# Altium project DC Motor Controller.PrjPcb
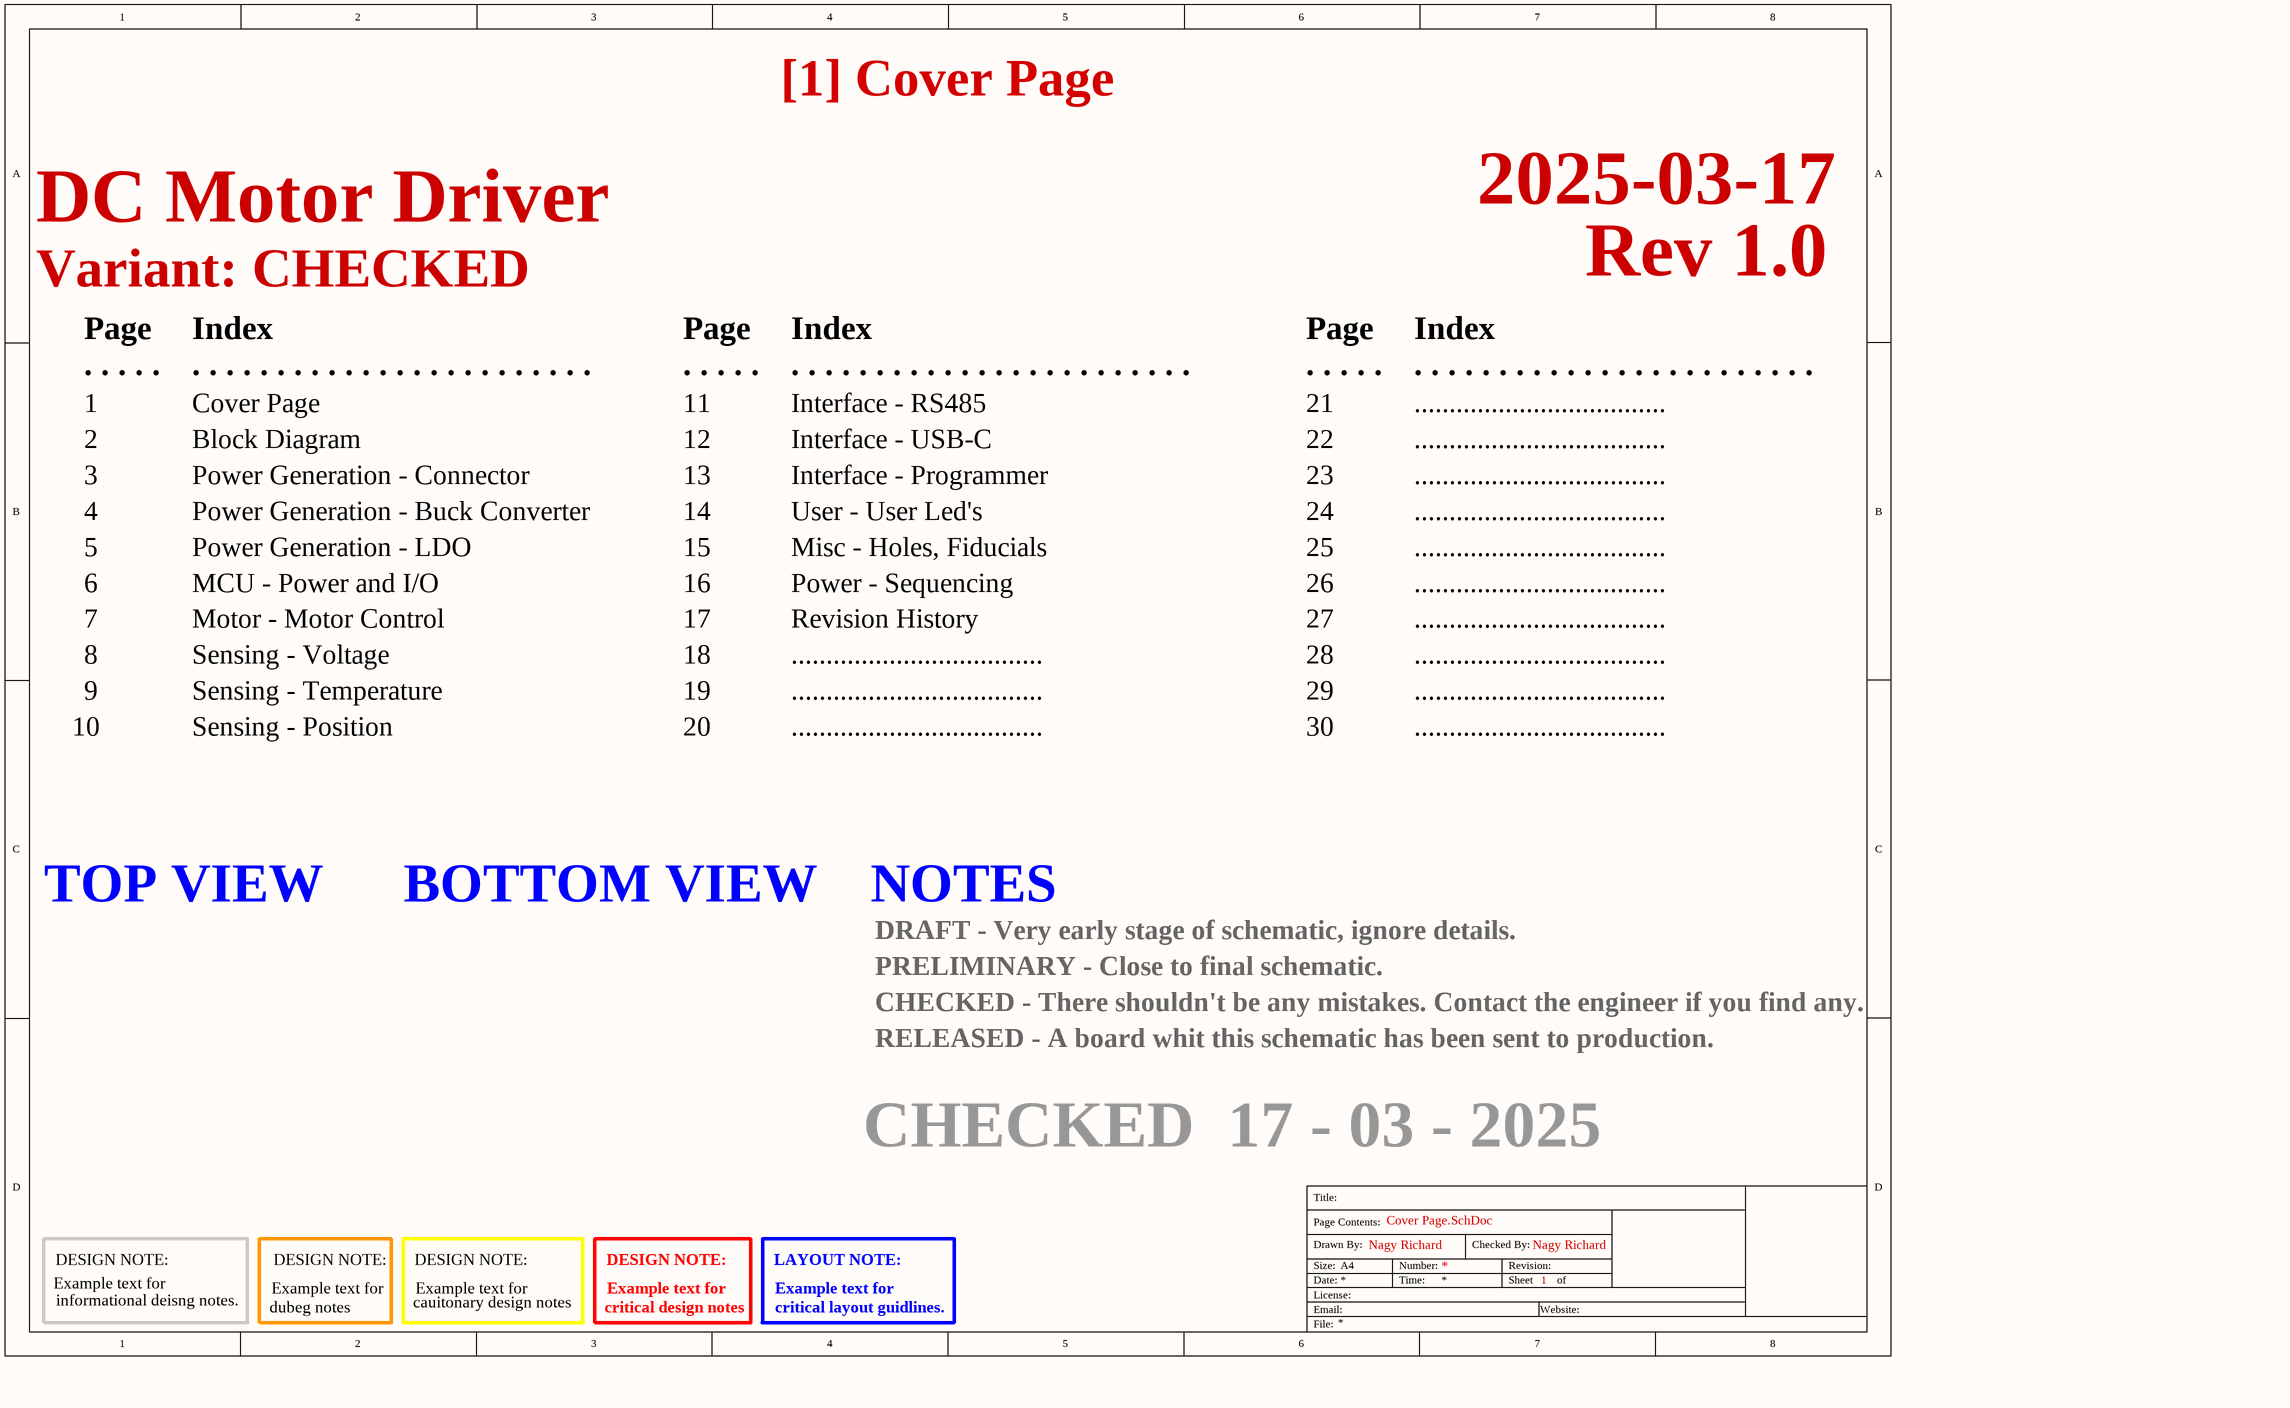
[diagram p0: Cover Page.SchDoc]
15 sheets, 95 parts. Net scope: global (net labels, ports and power ports of the same name join across sheets).
Board file: PCB.PcbDoc
Sheets:
  Cover Page.SchDoc
  Block Diagram.SchDoc
    U_Power Generation - Connector = Power Generation - Connector.SchDoc
    U_Power Generation - Buck Converter = Power Generation - Buck Converter.SchDoc
    U_Power Generation - LDO = Power Generation - LDO.SchDoc
    U_MCU - Power and I_O = MCU - Power and I_O.SchDoc
    U_Motor - Motor Control = Motor - Motor Control.SchDoc
    U_Sensing - Voltage = Sensing - Voltage.SchDoc
    U_Sensing - Temperature = Sensing - Temperature.SchDoc
    U_Sensing - Position = Sensing - Position.SchDoc
    U_Interface - RS485 = Interface - RS485.SchDoc
    U_Interface - USB-C = Interface - USB-C.SchDoc
    U_Interface - Programmer = Interface - Programmer.SchDoc
    U_User - User Led's = User - User Led's.SchDoc
  Misc - Holes, Fiducials.SchDoc

## Sheet Cover Page.SchDoc: [1] Cover Page
size A3; ApprovedBy: Nagy Richard; CheckedBy: Nagy Richard; Author: Nagy Richard; CompanyName: EmbedCore; DrawnBy: Nagy Richard; Engineer: Nagy Richard; Organization: EmbedCore; Revision: 1.0; SheetNumber: 1; SheetTotal: 15

### Notes on the sheet
- 2025-03-17
- DC Motor Driver
- Variant: CHECKED
- Page
- Index
- Rev 1.0
- . . . . .
- . . . . . . . . . . . . . . . . . . . . . . . .
- 1
- 2
- Cover Page
- Block Diagram
- 11
- 12
- Interface - RS485
- Interface - USB-C
- 21
- 22
- ....................................
- 3
- 4
- Power Generation - Connector
- Power Generation - Buck Converter
- 13
- 14
- Interface - Programmer
- User - User Led's
- 23
- 24
- 5
- Power Generation - LDO
- 15
- Misc - Holes, Fiducials
- 25
- 6
- 7
- MCU - Power and I/O
- Motor - Motor Control
- 16
- 17
- Power - Sequencing
- Revision History
- 26
- 27
- 8
- 9
- Sensing - Voltage
- Sensing - Temperature
- 18
- 19
- 28
- 29
- 10
- Sensing - Position
- 20
- 30
- TOP VIEW
- BOTTOM VIEW
- NOTES
- DRAFT - Very early stage of schematic, ignore details.
- CHECKED - There shouldn't be any mistakes. Contact the engineer if you find any.
- PRELIMINARY - Close to final schematic.
- RELEASED - A board whit this schematic has been sent to production.
- CHECKED  17 - 03 - 2025
- Example text for
- DESIGN NOTE:
- informational deisng notes.
- dubeg notes
- cauitonary design notes
- critical design notes
- LAYOUT NOTE:
- critical layout guidlines.
- Title:
- Drawn By:
- Page Contents:
- Checked By:
- Size:
- Date:
- File:
- License:
- Email:
- A4
- Number:
- Time:
- Revision:
- Sheet
- Website:
- of

## Sheet Block Diagram.SchDoc: [2] Block Diagram
size A4; ApprovedBy: Nagy Richard; CheckedBy: Nagy Richard; Author: Nagy Richard; CompanyName: EmbedCore; DrawnBy: Nagy Richard; Engineer: Nagy Richard; Organization: EmbedCore; DocumentNumber: 2; Revision: 1.0; SheetNumber: 2; SheetTotal: 14
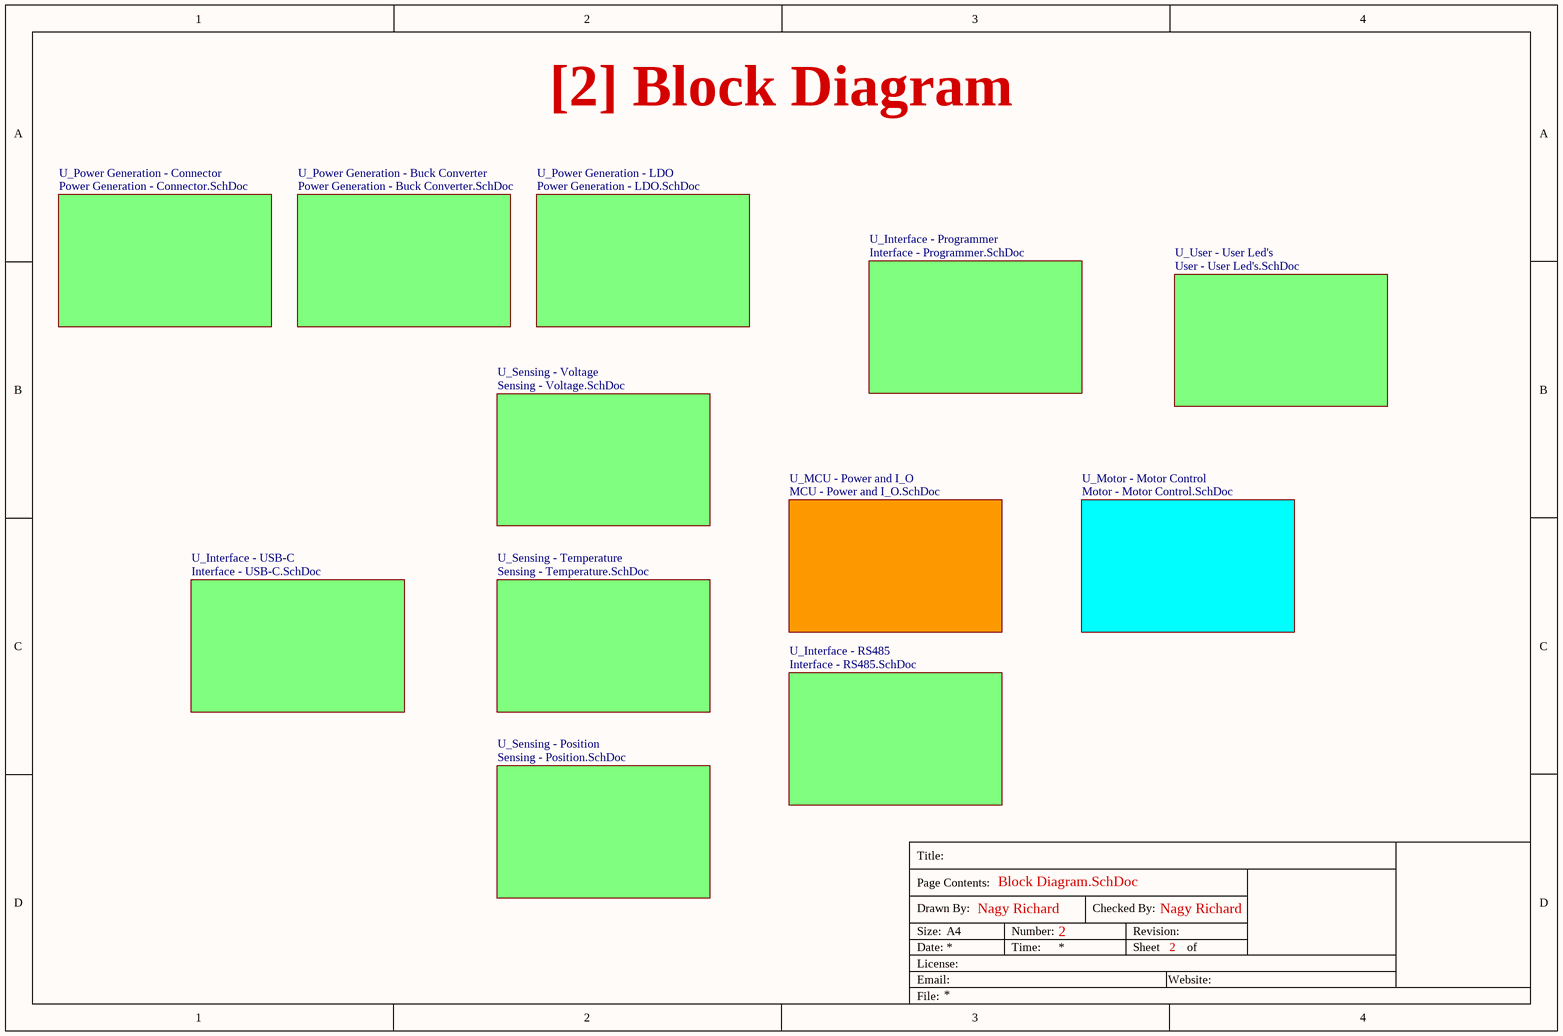
[diagram p1: Block Diagram.SchDoc]

### Sub-sheets
U_Interface - Programmer = Interface - Programmer.SchDoc: no entries
U_Interface - RS485 = Interface - RS485.SchDoc: no entries
U_Interface - USB-C = Interface - USB-C.SchDoc: no entries
U_MCU - Power and I_O = MCU - Power and I_O.SchDoc: no entries
U_Motor - Motor Control = Motor - Motor Control.SchDoc: no entries
U_Power Generation - Buck Converter = Power Generation - Buck Converter.SchDoc: no entries
U_Power Generation - Connector = Power Generation - Connector.SchDoc: no entries
U_Power Generation - LDO = Power Generation - LDO.SchDoc: no entries
U_Sensing - Position = Sensing - Position.SchDoc: no entries
U_Sensing - Temperature = Sensing - Temperature.SchDoc: no entries
U_Sensing - Voltage = Sensing - Voltage.SchDoc: no entries
U_User - User Led's = User - User Led's.SchDoc: no entries

### Notes on the sheet
- Title:
- Drawn By:
- Page Contents:
- Checked By:
- Size:
- Date:
- File:
- License:
- Email:
- A4
- Number:
- Time:
- Revision:
- Sheet
- Website:
- of

## Sheet Power Generation - Connector.SchDoc: [3] Power Generation - Connector
size A4; ApprovedBy: Nagy Richard; CheckedBy: Nagy Richard; Author: Nagy Richard; CompanyName: EmbedCore; DrawnBy: Nagy Richard; Engineer: Nagy Richard; Organization: EmbedCore; DocumentNumber: 3; Revision: 1.0; SheetNumber: 3; SheetTotal: 15
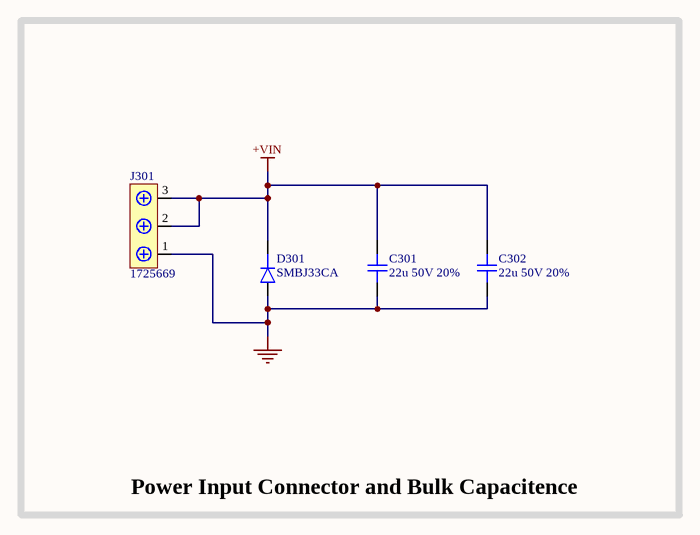
[diagram p2: Power Generation - Connector.SchDoc]

### Parts
C301  22u 50V 20%  [CAP-EL-NP-5MM]
C302  22u 50V 20%  [CAP-EL-NP-5MM]
D301  SMBJ33CA  [DO-214AC-2 (SMA)]
J301  1725669  [1725669]

### Blocks framed on the sheet
Power Input Connector and Bulk Capacitence: C301 C302 D301 J301

### Nets
+VIN: C301.1 C302.1 D301.K J301.2 J301.3
GND: C301.2 C302.2 D301.A J301.1

### Notes on the sheet
- Title:
- Drawn By:
- Page Contents:
- Checked By:
- Size:
- Date:
- File:
- License:
- Email:
- A4
- Number:
- Time:
- Revision:
- Sheet
- Website:
- of

### Library data of the parts
C301 C302 = CAP_EL_NP_5MM: Capacitor SMD Electrolytic Non-Polarised 5mm Diameter; Manufacturer: PANASONIC; Manufacturer Part Number: EEEFT1H220AR
D301 = D_SMA: Diode SMD SMA (DO-214AA); Manufacturer: Littelfuse; Manufacturer Part Number: SMBJ33CA
J301 = 1725669: Screw Terminal Block 3 Positions 2.54mm; Manufacturer: Phoenix; Manufacturer Part Number: 1725669; Distributor Link: https://www.mouser.de/ProductDetail/Phoenix-Contact/1725669?qs=A%2FKWGUWTCZjmkTL0Oe91ew%3D%3D

## Sheet Power Generation - Buck Converter.SchDoc: [4] Power Generation - Buck Converter
size A4; ApprovedBy: Nagy Richard; CheckedBy: Nagy Richard; Author: Nagy Richard; CompanyName: EmbedCore; DrawnBy: Nagy Richard; Engineer: Nagy Richard; Organization: EmbedCore; DocumentNumber: 4; Revision: 1.0; SheetNumber: 4; SheetTotal: 15
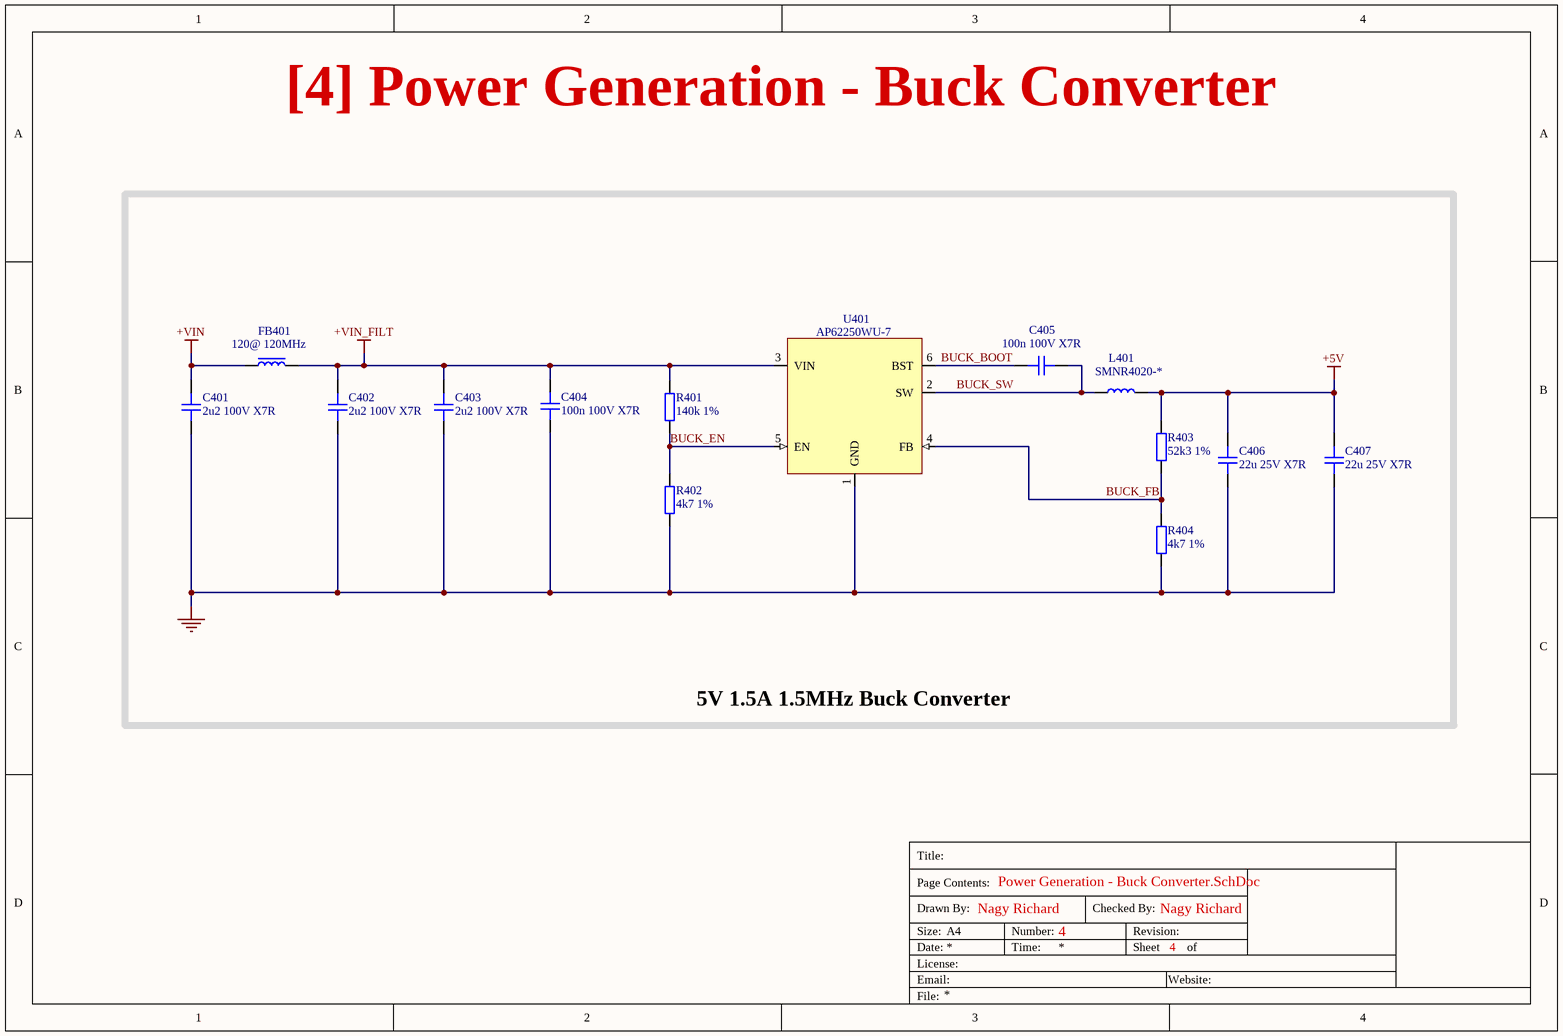
[diagram p3: Power Generation - Buck Converter.SchDoc]

### Parts
C401  2u2 100V X7R  [CAP_0805]
C402  2u2 100V X7R  [CAP_0805]
C403  2u2 100V X7R  [CAP_0805]
C404  100n 100V X7R  [CAP_0805]
C405  100n 100V X7R  [CAP_0805]
C406  22u 25V X7R  [CAP_0805]
C407  22u 25V X7R  [CAP_0805]
FB401  120@ 120MHz  [FB_0805]
L401  SMNR4020-*  [SMNR4020]
R401  140k 1%  [RES_0603]
R402  4k7 1%  [RES_0603]
R403  52k3 1%  [RES_0603]
R404  4k7 1%  [RES_0603]
U401  AP62250WU-7  [TSOT-26-6]

### Blocks framed on the sheet
5V 1.5A 1.5MHz Buck Converter: C401-C407 FB401 L401 R401-R404 U401

### Nets
+5V: C406.2 C407.2 L401.2 R403.2
+VIN: C401.2 FB401.1
+VIN_FILT: C402.2 C403.2 C404.2 FB401.2 R401.2 U401.3(VIN)
GND: C401.1 C402.1 C403.1 C404.1 C406.1 C407.1 R402.1 R404.1 U401.1(GND)
BUCK_BOOT: C405.2 U401.6(BST)
BUCK_EN: R401.1 R402.2 U401.5(EN)
BUCK_FB: R403.1 R404.2 U401.4(FB)
BUCK_SW: C405.1 L401.1 U401.2(SW)

### Notes on the sheet
- Title:
- Drawn By:
- Page Contents:
- Checked By:
- Size:
- Date:
- File:
- License:
- Email:
- A4
- Number:
- Time:
- Revision:
- Sheet
- Website:
- of

### Library data of the parts
C401-C403 C406 C407 = CAP_0805: Capacitor SMD 0805; Manufacturer: *; Manufacturer Part Number: *; Distributor Link: *; LCSC: *; Rating: *; Dielectric: *
C404 C405 = CAP_0805: Capacitor SMD 0805; Manufacturer: HUI JU; Manufacturer Part Number: NM0805B104K101CEDN; Distributor Link: www.lcsc.com; LCSC: C710457; Rating: *; Dielectric: *
FB401 = FB_0805: Ferrite Bead SMD 0805; Manufacturer: Murata Electronics; Manufacturer Part Number: BLM21AG121SN1D; Distributor Link: www.lcsc.com; LCSC: C88990
L401 = SMNR4020-*: Inductor SXN SMNR4020 Series 4x4x2mm; Manufacturer Part Number: SMNR4020-5R6MT; Manufacturer: SXN; Distributor Link: www.lcsc.com; LCSC: C467062
R401 = RES_0603: Resistor SMD 0603; Manufacturer: YAGEO; Manufacturer Part Number: RC0603FR-07140KL; Distributor Link: www.lcsc.com; LCSC: C185372
R402 R404 = RES_0603: Resistor SMD 0603; Manufacturer: UNI-ROYAL(Uniroyal Elec); Manufacturer Part Number: 0603WAF4701T5E; Distributor Link: www.lcsc.com; LCSC: C23162
R403 = RES_0603: Resistor SMD 0603; Manufacturer: UNI-ROYAL(Uniroyal Elec); Manufacturer Part Number: 0603WAF5232T5E; Distributor Link: www.lcsc.com; LCSC: C23198
U401 = AP62250WU-7: 4.2V TO 18V INPUT, 2.5A LOW IQ SYNCHRONOUS BUCK CONVERTER; Manufacturer: Diodes Incorporated; Manufacturer Part Number: AP62250WU-7; Distributor Link: https://www.mouser.de/ProductDetail/Diodes-Incorporated/AP62250WU-7?qs=7MVldsJ5Uax1PUc8sdeimQ%3D%3D

## Sheet Power Generation - LDO.SchDoc: [4] Power Generation - LDO
size A4; ApprovedBy: Nagy Richard; CheckedBy: Nagy Richard; Author: Nagy Richard; CompanyName: EmbedCore; DrawnBy: Nagy Richard; Engineer: Nagy Richard; Organization: EmbedCore; DocumentNumber: 5; Revision: 1.0; SheetNumber: 5; SheetTotal: 5
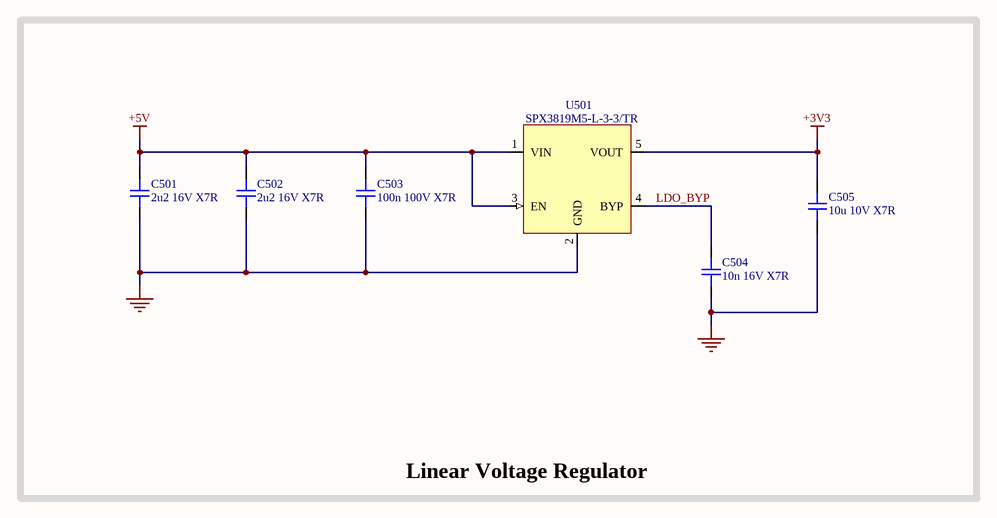
[diagram p4: Power Generation - LDO.SchDoc]

### Parts
C501  2u2 16V X7R  [CAP_0805]
C502  2u2 16V X7R  [CAP_0805]
C503  100n 100V X7R  [CAP_0805]
C504  10n 16V X7R  [CAP_0603]
C505  10u 10V X7R  [CAP_0805]
U501  SPX3819M5-L-3-3/TR  [SOT-23-5]

### Blocks framed on the sheet
Linear Voltage Regulator: C501-C505 U501

### Nets
+3V3: C505.1 U501.5(VOUT)
+5V: C501.1 C502.1 C503.1 U501.1(VIN) U501.3(EN)
GND: C501.2 C502.2 C503.2 C504.1 C505.2 U501.2(GND)
LDO_BYP: C504.2 U501.4(BYP)

### Notes on the sheet
- Title:
- Drawn By:
- Page Contents:
- Checked By:
- Size:
- Date:
- File:
- License:
- Email:
- A4
- Number:
- Time:
- Revision:
- Sheet
- Website:
- of

### Library data of the parts
C501 C502 = CAP_0805: Capacitor SMD 0805; Manufacturer: HRE; Manufacturer Part Number: CGA0805X7R225K160MT; Distributor Link: www.lcsc.com; LCSC: C6119936; Rating: *; Dielectric: *
C503 = CAP_0805: Capacitor SMD 0805; Manufacturer: YAGEO; Manufacturer Part Number: CC0805JRX7R7BB104; Distributor Link: www.lcsc.com; LCSC: CC0805JRX7R7BB104; Rating: *; Dielectric: *
C504 = CAP_0603: Capacitor SMD 0603; Manufacturer: YAGEO; Manufacturer Part Number: CC0603JRX7R7BB103; Distributor Link: www.lcsc.com; LCSC: C519509; Rating: *; Dielectric: *
C505 = CAP_0805: Capacitor SMD 0805; Manufacturer: Murata Electronics; Manufacturer Part Number: GCM21BR71A106KE22K; Distributor Link: www.lcsc.com; LCSC: C2167756; Rating: *; Dielectric: *
U501 = SPX3819M5-L-3-3/TR: 500mA +3.3V Low-Noise LDO Voltage Regulator; Manufacturer: MaxLinear; Manufacturer Part Number: SPX3819M5-L-3-3/TR

## Sheet MCU - Power and I_O.SchDoc: [6] MCU - Power and I/O
size A4; ApprovedBy: Nagy Richard; CheckedBy: Nagy Richard; Author: Nagy Richard; CompanyName: EmbedCore; DrawnBy: Nagy Richard; Engineer: Nagy Richard; DocumentNumber: 6; Revision: 1.0; SheetNumber: 6; SheetTotal: 15
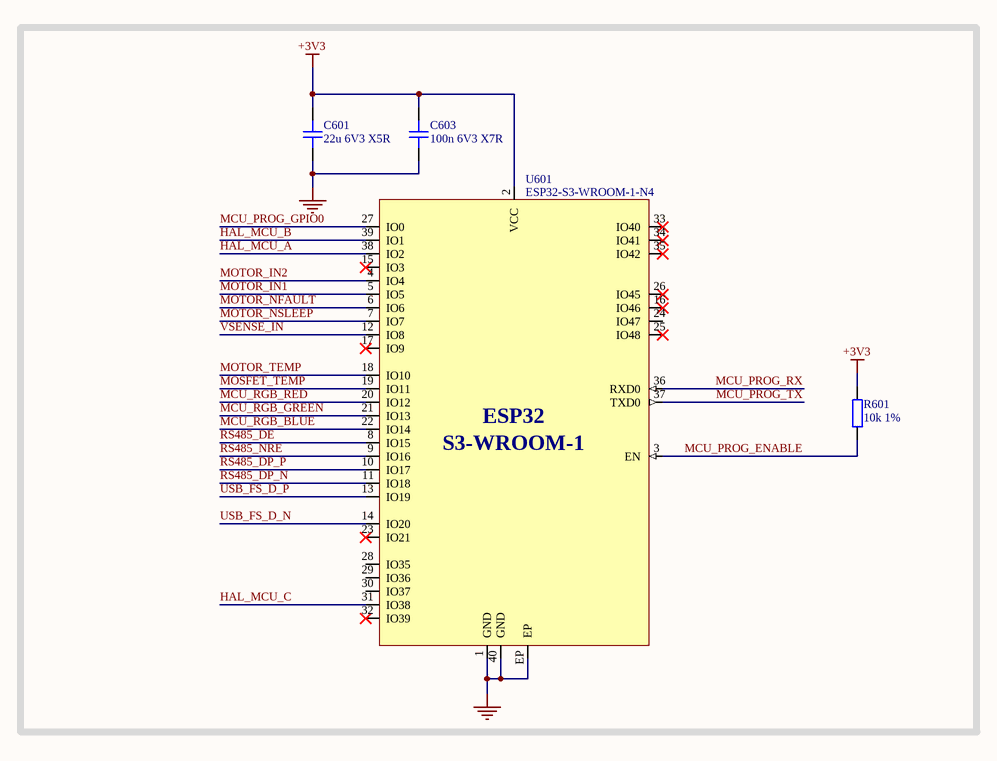
[diagram p5: MCU - Power and I_O.SchDoc]

### Parts
C601  22u 6V3 X5R  [CAP_0603]
C603  100n 6V3 X7R  [CAP_0402]
R601  10k 1%  [RES_0402]
U601  ESP32-S3-WROOM-1-N4  [ESP32-S3-WROOM-1]

### Nets
+3V3: C601.2 C603.2 R601.2 U601.2(VCC)
GND: C601.1 C603.1 U601.1(GND) U601.40(GND) U601.EP
HAL_MCU_A: U601.38(IO2)
HAL_MCU_B: U601.39(IO1)
HAL_MCU_C: U601.31(IO38)
MCU_PROG_ENABLE: R601.1 U601.3(EN)
MCU_PROG_GPIO0: U601.27(IO0)
MCU_PROG_RX: U601.36(RXD0)
MCU_PROG_TX: U601.37(TXD0)
MCU_RGB_BLUE: U601.22(IO14)
MCU_RGB_GREEN: U601.21(IO13)
MCU_RGB_RED: U601.20(IO12)
MOSFET_TEMP: U601.19(IO11)
MOTOR_IN1: U601.5(IO5)
MOTOR_IN2: U601.4(IO4)
MOTOR_NFAULT: U601.6(IO6)
MOTOR_NSLEEP: U601.7(IO7)
MOTOR_TEMP: U601.18(IO10)
RS485_DE: U601.8(IO15)
RS485_DP_N: U601.11(IO18)
RS485_DP_P: U601.10(IO17)
RS485_NRE: U601.9(IO16)
USB_FS_D_N: U601.14(IO20)
USB_FS_D_P: U601.13(IO19)
VSENSE_IN: U601.12(IO8)

Not connected (* = marked no-connect by the designer): U601 15(IO3)* 16(IO46)* 17(IO9)* 23(IO21)* 24(IO47) 25(IO48)* 26(IO45)* 28(IO35) 29(IO36) 30(IO37) 32(IO39)* 33(IO40)* 34(IO41)* 35(IO42)*

### Notes on the sheet
- Title:
- Drawn By:
- Page Contents:
- Checked By:
- Size:
- Date:
- File:
- License:
- Email:
- A4
- Number:
- Time:
- Revision:
- Sheet
- Website:
- of
- (in symbol ESP32-S3-WROOM-1-N4) ESP32; S3-WROOM-1

### Library data of the parts
C601 = CAP_0603: Capacitor SMD 0603; Manufacturer: Samsung Electro-Mechanics; Manufacturer Part Number: CL10A226MQ8NRNC; Distributor Link: www.lcsc.com; LCSC: C59461; Rating: *; Dielectric: *
C603 = CAP_0402: Capacitor SMD 0402; Manufacturer: YAGEO; Manufacturer Part Number: CC0402KRX7R5BB104; Distributor Link: www.lcsc.com; LCSC: C541406; Rating: *; Dielectric: *
R601 = RES_0402: Resistor SMD 0402; Manufacturer: PANASONIC; Manufacturer Part Number: ERJPA2F1002X; Distributor Link: www.lcsc.com; LCSC: C427247
U601 = ESP32-S3-WROOM-1-N4: 2.4 GHz Wi-Fi (802.11 b/g/n) and Bluetooth 5 (LE) Module ESP32-S3, 4MB Flash, on-board PCB antenna); Manufacturer: Espressif; Manufacturer Part Number: ESP32-S3-WROOM-1-N4; Distributor Link: https://www.mouser.de/ProductDetail/Espressif-Systems/ESP32-S3-WROOM-1-N4?qs=Li%252BoUPsLEnsO%2FkiJOUK0FQ%3D%3D

## Sheet Motor - Motor Control.SchDoc: [7] Motor - Motor Control
size A4; ApprovedBy: Nagy Richard; CheckedBy: Nagy Richard; Author: Nagy Richard; CompanyName: EmbedCore; DrawnBy: Nagy Richard; Engineer: Nagy Richard; Organization: EmbedCore; DocumentNumber: 7; Revision: 1.0; SheetNumber: 7; SheetTotal: 15
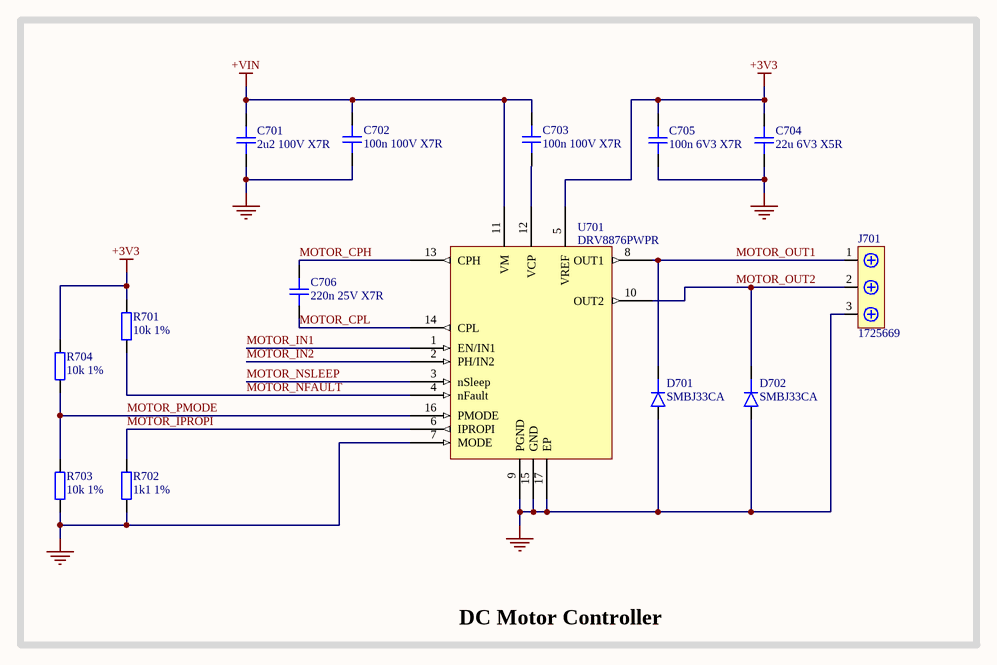
[diagram p6: Motor - Motor Control.SchDoc]

### Parts
C701  2u2 100V X7R  [CAP_0805]
C702  100n 100V X7R  [CAP_0603]
C703  100n 100V X7R  [CAP_0603]
C704  22u 6V3 X5R  [CAP_0603]
C705  100n 6V3 X7R  [CAP_0402]
C706  220n 25V X7R  [CAP_0603]
D701  SMBJ33CA  [DO-214AC-2 (SMA)]
D702  SMBJ33CA  [DO-214AC-2 (SMA)]
J701  1725669  [1725669]
R701  10k 1%  [RES_0402]
R702  1k1 1%  [RES_0402]
R703  10k 1%  [RES_0402]
R704  10k 1%  [RES_0402]
U701  DRV8876PWPR  [SOP65P640X120-16N]

### Blocks framed on the sheet
DC Motor Controller: C701-C706 D701 D702 J701 R701-R704 U701

### Nets
+3V3: C704.2 C705.2 R701.2 R704.2 U701.5(VREF)
+VIN: C701.2 C702.2 C703.2 U701.11(VM)
GND: C701.1 C702.1 C704.1 C705.1 D701.A D702.A J701.3 R702.1 R703.1 U701.7(MODE) U701.9(PGND) U701.15(GND) U701.17(EP)
MOTOR_CPH: C706.2 U701.13(CPH)
MOTOR_CPL: C706.1 U701.14(CPL)
MOTOR_IN1: U701.1(EN/IN1)
MOTOR_IN2: U701.2(PH/IN2)
MOTOR_IPROPI: R702.2 U701.6(IPROPI)
MOTOR_NFAULT: R701.1 U701.4(nFault)
MOTOR_NSLEEP: U701.3(nSleep)
MOTOR_OUT1: D701.K J701.1 U701.8(OUT1)
MOTOR_OUT2: D702.K J701.2 U701.10(OUT2)
MOTOR_PMODE: R703.2 R704.1 U701.16(PMODE)
NetC703_1: C703.1 U701.12(VCP)

### Notes on the sheet
- Title:
- Drawn By:
- Page Contents:
- Checked By:
- Size:
- Date:
- File:
- License:
- Email:
- A4
- Number:
- Time:
- Revision:
- Sheet
- Website:
- of

### Library data of the parts
C701 = CAP_0805: Capacitor SMD 0805; Manufacturer: *; Manufacturer Part Number: *; Distributor Link: *; LCSC: *; Rating: *; Dielectric: *
C702 C703 = CAP_0603: Capacitor SMD 0603; Manufacturer: *; Manufacturer Part Number: *; Distributor Link: *; LCSC: *; Rating: *; Dielectric: *
C704 C706 = CAP_0603: as C601 on sheet MCU - Power and I_O; Distributor Link: www.lcsc.com; Rating: *; Dielectric: *
  C704: LCSC: C59461
  C706: LCSC: C21120
C705 = CAP_0402: as C603 on sheet MCU - Power and I_O; Distributor Link: www.lcsc.com; LCSC: C541406; Rating: *; Dielectric: *
D701 D702 = D_SMA: as D301 on sheet Power Generation - Connector; Manufacturer Part Number: SMBJ33CA
J701 = 1725669: as J301 on sheet Power Generation - Connector; Manufacturer Part Number: 1725669; Distributor Link: https://www.mouser.de/ProductDetail/Phoenix-Contact/1725669?qs=A%2FKWGUWTCZjmkTL0Oe91ew%3D%3D
R701-R704 = RES_0402: as R601 on sheet MCU - Power and I_O; Distributor Link: www.lcsc.com
  R701 R703 R704: LCSC: C427247
  R702: LCSC: C409028
U701 = DRV8876PWPR: DRV8876 H-Bridge Motor Driver With Integrated Current Sense and Regulation; Manufacturer: Texas Instruments; LCSC: C575551

## Sheet Sensing - Voltage.SchDoc: [8] Sensing - Voltage
size A4; ApprovedBy: Nagy Richard; CheckedBy: Nagy Richard; Author: Nagy Richard; CompanyName: EmbedCore; DrawnBy: Nagy Richard; Engineer: Nagy Richard; Organization: EmbedCore; DocumentNumber: 8; Revision: 1.0; SheetNumber: 8; SheetTotal: 8
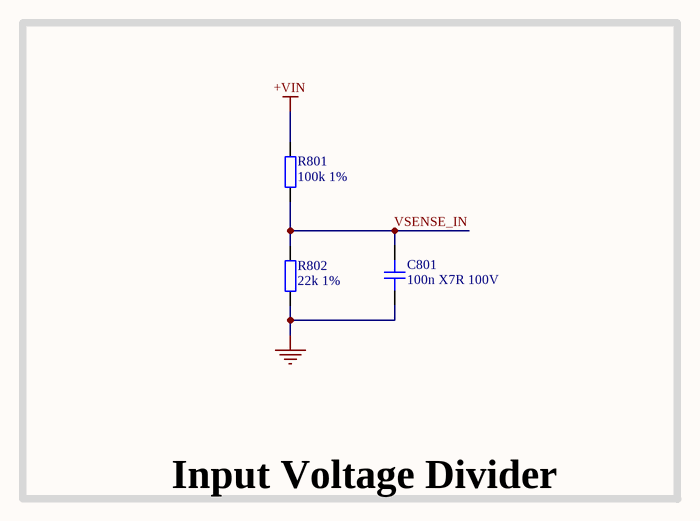
[diagram p7: Sensing - Voltage.SchDoc]

### Parts
C801  100n X7R 100V  [CAP_0603]
R801  100k 1%  [RES_0603]
R802  22k 1%  [RES_0603]

### Blocks framed on the sheet
Input Voltage Divider: C801 R801 R802

### Nets
+VIN: R801.2
GND: C801.1 R802.1
VSENSE_IN: C801.2 R801.1 R802.2

### Notes on the sheet
- Title:
- Drawn By:
- Page Contents:
- Checked By:
- Size:
- Date:
- File:
- License:
- Email:
- A4
- Number:
- Time:
- Revision:
- Sheet
- Website:
- of

### Library data of the parts
C801 = CAP_0603: Capacitor SMD 0603; Manufacturer: CCTC; Manufacturer Part Number: TCC0603X7R104K101CT; Distributor Link: www.lcsc.com; LCSC: C696916; Rating: *; Dielectric: *
R801 = RES_0603: Resistor SMD 0603; Manufacturer: Vishay Intertech; Manufacturer Part Number: MCT06030C1003FP500; Distributor Link: www.lcsc.com; LCSC: C161805
R802 = RES_0603: Resistor SMD 0603; Manufacturer: Vishay Intertech; Manufacturer Part Number: CRCW060322K0FKEA; Distributor Link: www.lcsc.com; LCSC: C844758

## Sheet Sensing - Temperature.SchDoc: [9] Sensing - Temperature
size A4; ApprovedBy: Nagy Richard; CheckedBy: Nagy Richard; Author: Nagy Richard; CompanyName: EmbedCore; DrawnBy: Nagy Richard; Engineer: Nagy Richard; Organization: EmbedCore; DocumentNumber: 9; Revision: 1.0; SheetNumber: 9; SheetTotal: 15
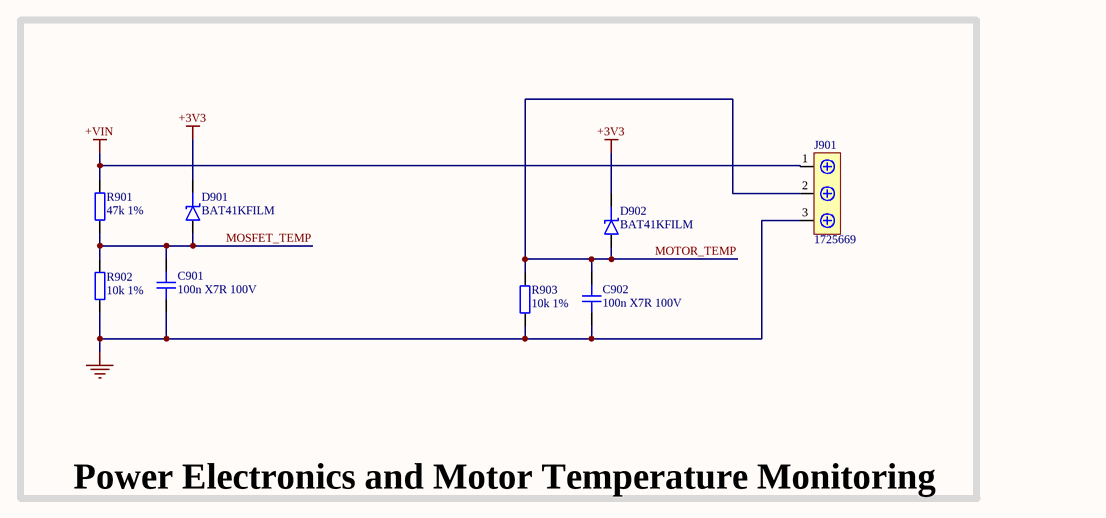
[diagram p8: Sensing - Temperature.SchDoc]

### Parts
C901  100n X7R 100V  [CAP_0603]
C902  100n X7R 100V  [CAP_0603]
D901  BAT41KFILM  [SOD-523]
D902  BAT41KFILM  [SOD-523]
J901  1725669  [1725669]
R901  47k 1%  [RES_0603]
R902  10k 1%  [RES_0603]
R903  10k 1%  [RES_0603]

### Blocks framed on the sheet
Power Electronics and Motor Temperature Monitoring: C901 C902 D901 D902 J901 R901-R903

### Nets
+3V3: D901.K D902.K
+VIN: J901.1 R901.2
GND: C901.1 C902.1 J901.3 R902.1 R903.1
MOSFET_TEMP: C901.2 D901.A R901.1 R902.2
MOTOR_TEMP: C902.2 D902.A J901.2 R903.2

### Notes on the sheet
- Title:
- Drawn By:
- Page Contents:
- Checked By:
- Size:
- Date:
- File:
- License:
- Email:
- A4
- Number:
- Time:
- Revision:
- Sheet
- Website:
- of

### Library data of the parts
C901 C902 = CAP_0603: as C801 on sheet Sensing - Voltage; Distributor Link: www.lcsc.com; LCSC: C696916; Rating: *; Dielectric: *
D901 D902 = D_SCHOTTKY_SOD_523: Diode Schottky SMD SOD-323; Manufacturer: STMicroelectronics; Manufacturer Part Number: BAT41KFILM; LCSC: C73150
J901 = 1725669: as J301 on sheet Power Generation - Connector; Manufacturer Part Number: 1725669; Distributor Link: https://www.mouser.de/ProductDetail/Phoenix-Contact/1725669?qs=A%2FKWGUWTCZjmkTL0Oe91ew%3D%3D
R901 = RES_0603: Resistor SMD 0603; Manufacturer: Vishay Intertech; Manufacturer Part Number: NTCS0603E3473FHT; Distributor Link: www.lcsc.com; LCSC: C511055
R902 R903 = RES_0603: as R401 on sheet Power Generation - Buck Converter; Distributor Link: www.lcsc.com; LCSC: C185372

## Sheet Sensing - Position.SchDoc: [10] Sensing - Position
size A4; ApprovedBy: Nagy Richard; CheckedBy: Nagy Richard; Author: Nagy Richard; CompanyName: EmbedCore; DrawnBy: Nagy Richard; Engineer: Nagy Richard; Organization: EmbedCore; DocumentNumber: 10; Revision: 1.0; SheetNumber: 10; SheetTotal: 15
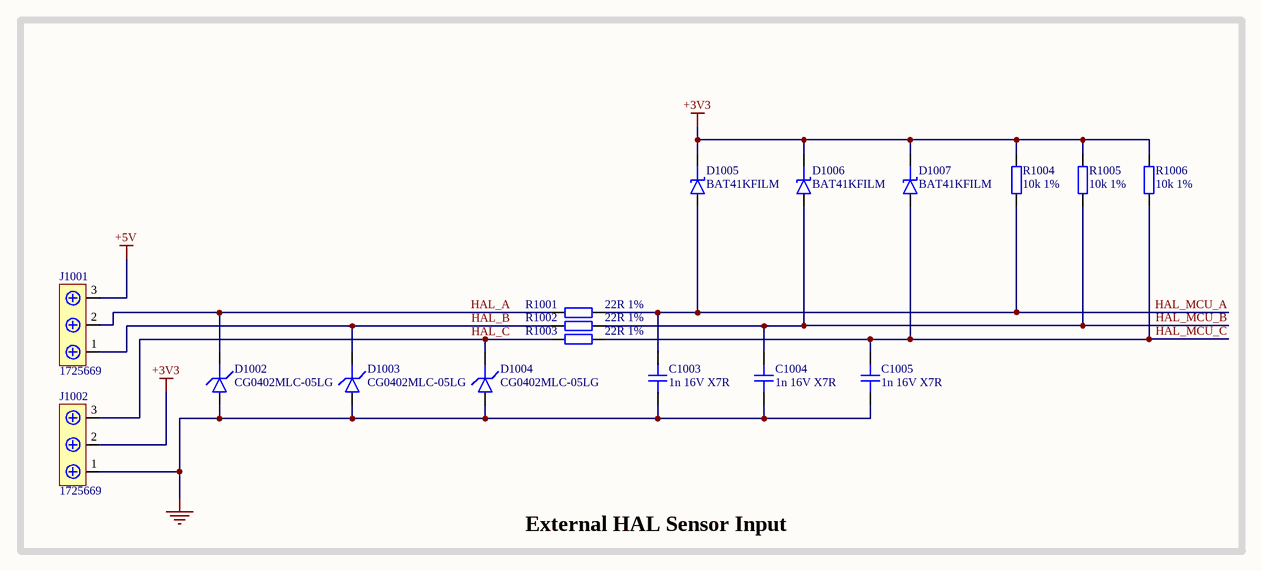
[diagram p9: Sensing - Position.SchDoc]

### Parts
C1003  1n 16V X7R  [CAP_0402]
C1004  1n 16V X7R  [CAP_0402]
C1005  1n 16V X7R  [CAP_0402]
D1002  CG0402MLC-05LG  [D_0402]
D1003  CG0402MLC-05LG  [D_0402]
D1004  CG0402MLC-05LG  [D_0402]
D1005  BAT41KFILM  [SOD-523]
D1006  BAT41KFILM  [SOD-523]
D1007  BAT41KFILM  [SOD-523]
J1001  1725669  [1725669]
J1002  1725669  [1725669]
R1001  22R 1%  [RES_0402]
R1002  22R 1%  [RES_0402]
R1003  22R 1%  [RES_0402]
R1004  10k 1%  [RES_0402]
R1005  10k 1%  [RES_0402]
R1006  10k 1%  [RES_0402]

### Blocks framed on the sheet
External HAL Sensor Input: C1003-C1005 D1002-D1007 J1001 J1002 R1001-R1006

### Nets
+3V3: D1005.K D1006.K D1007.K J1002.2 R1004.2 R1005.2 R1006.2
+5V: J1001.3
GND: C1003.1 C1004.1 C1005.1 D1002.A D1003.A D1004.A J1002.1
HAL_A: D1002.K J1001.2 R1001.2
HAL_B: D1003.K J1001.1 R1002.2
HAL_C: D1004.K J1002.3 R1003.2
HAL_MCU_A: C1003.2 D1005.A R1001.1 R1004.1
HAL_MCU_B: C1004.2 D1006.A R1002.1 R1005.1
HAL_MCU_C: C1005.2 D1007.A R1003.1 R1006.1

### Notes on the sheet
- Title:
- Drawn By:
- Page Contents:
- Checked By:
- Size:
- Date:
- File:
- License:
- Email:
- A4
- Number:
- Time:
- Revision:
- Sheet
- Website:
- of

### Library data of the parts
C1003-C1005 = CAP_0402: Capacitor SMD 0402; Manufacturer: YAGEO; Manufacturer Part Number: CC0402KRX7R7BB102; Distributor Link: www.lcsc.com; LCSC: C189467; Rating: *; Dielectric: *
D1002 = D_TVS_0402: Diode TVS / ESD 0402; Manufacturer: BOURNS; Manufacturer Part Number: CG0402MLC-05LG; LCSC: C711709
D1003 D1004 = D_TVS_0402: Diode TVS / ESD 0402
D1005-D1007 = D_SCHOTTKY_SOD_523: as D901 on sheet Sensing - Temperature; Manufacturer Part Number: BAT41KFILM; LCSC: C73150
J1001 J1002 = 1725669: as J301 on sheet Power Generation - Connector; Manufacturer Part Number: 1725669; Distributor Link: https://www.mouser.de/ProductDetail/Phoenix-Contact/1725669?qs=A%2FKWGUWTCZjmkTL0Oe91ew%3D%3D
R1001-R1003 = RES_0402: Resistor SMD 0402; Manufacturer: PANASONIC; Manufacturer Part Number: ERJPA2F22R0X; Distributor Link: www.lcsc.com; LCSC: C427230
R1004-R1006 = RES_0402: as R601 on sheet MCU - Power and I_O; Distributor Link: www.lcsc.com; LCSC: C427247

## Sheet Interface - RS485.SchDoc: [11] Interface - RS485
size A4; ApprovedBy: Nagy Richard; CheckedBy: Nagy Richard; Author: Nagy Richard; CompanyName: EmbedCore; DrawnBy: Nagy Richard; Engineer: Nagy Richard; Organization: EmbedCore; DocumentNumber: 11; Revision: 1.0; SheetNumber: 11; SheetTotal: 11
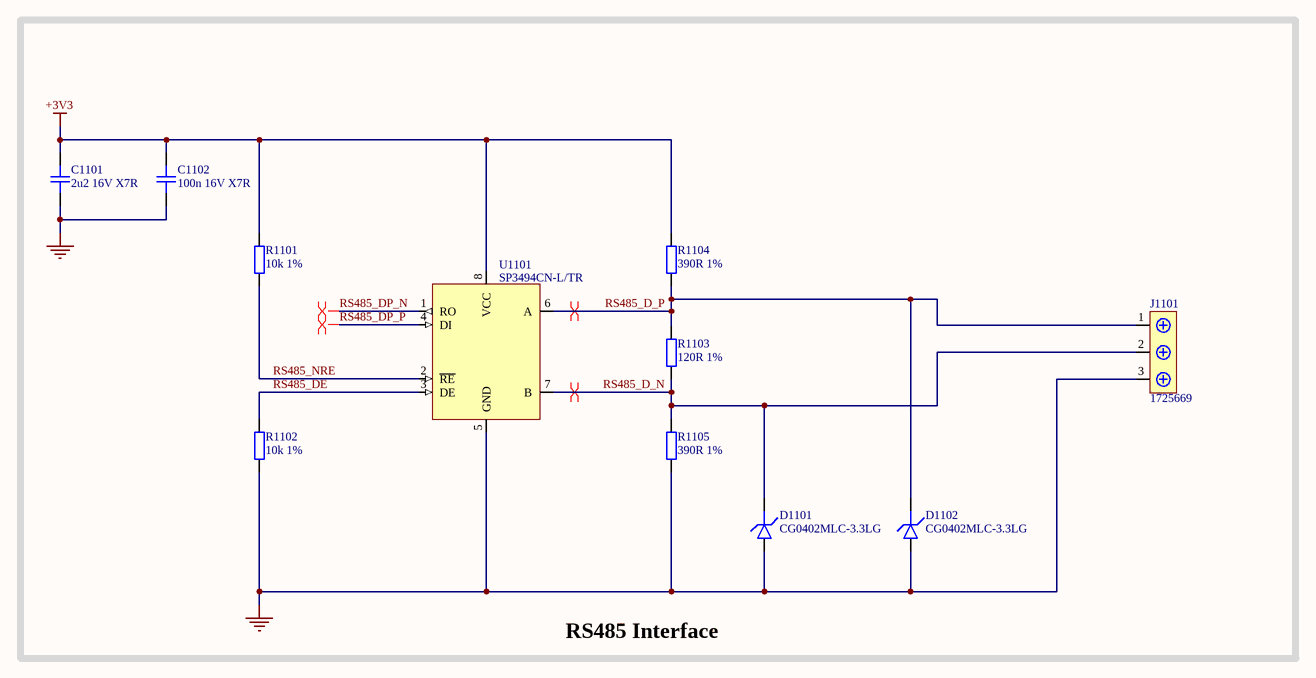
[diagram p10: Interface - RS485.SchDoc]

### Parts
C1101  2u2 16V X7R  [CAP_0603]
C1102  100n 16V X7R  [CAP_0402]
D1101  CG0402MLC-3.3LG  [D_0402]
D1102  CG0402MLC-3.3LG  [D_0402]
J1101  1725669  [1725669]
R1101  10k 1%  [RES_0402]
R1102  10k 1%  [RES_0402]
R1103  120R 1%  [RES_0402]
R1104  390R 1%  [RES_0402]
R1105  390R 1%  [RES_0402]
U1101  SP3494CN-L/TR  [SOIC-8]

### Blocks framed on the sheet
RS485 Interface: C1101 C1102 D1101 D1102 J1101 R1101-R1105 U1101

### Nets
+3V3: C1101.2 C1102.2 R1101.2 R1104.2 U1101.8(VCC)
GND: C1101.1 C1102.1 D1101.A D1102.A J1101.3 R1102.1 R1105.1 U1101.5(GND)
RS485_D_N: D1101.K J1101.2 R1103.1 R1105.2 U1101.7(B)
RS485_D_P: D1102.K J1101.1 R1103.2 R1104.1 U1101.6(A)
RS485_DE: R1102.2 U1101.3(DE)
RS485_DP_N: U1101.1(RO)
RS485_DP_P: U1101.4(DI)
RS485_NRE: R1101.1 U1101.2(~{RE})

### Layout directives
differential pair: RS485_D_N, RS485_D_P, RS485_DP_N, RS485_DP_P

### Notes on the sheet
- Title:
- Drawn By:
- Page Contents:
- Checked By:
- Size:
- Date:
- File:
- License:
- Email:
- A4
- Number:
- Time:
- Revision:
- Sheet
- Website:
- of

### Library data of the parts
C1101 = CAP_0603: Capacitor SMD 0603; Manufacturer: YAGEO; Manufacturer Part Number: CC0603KRX7R7BB225; Distributor Link: www.lcsc.com; LCSC: C914769; Rating: *; Dielectric: *
C1102 = CAP_0402: Capacitor SMD 0402; Manufacturer: YAGEO; Manufacturer Part Number: CC0402JRX7R7BB104; Distributor Link: www.lcsc.com; LCSC: C541464; Rating: *; Dielectric: *
D1101 D1102 = D_TVS_0402: Diode TVS / ESD 0402
J1101 = 1725669: as J301 on sheet Power Generation - Connector; Manufacturer Part Number: 1725669; Distributor Link: https://www.mouser.de/ProductDetail/Phoenix-Contact/1725669?qs=A%2FKWGUWTCZjmkTL0Oe91ew%3D%3D
R1101 R1102 = RES_0402: as R601 on sheet MCU - Power and I_O; Distributor Link: www.lcsc.com; LCSC: C427247
R1103 = RES_0402: Resistor SMD 0402; Manufacturer: PANASONIC; Manufacturer Part Number: ERJ2GEJ121X; Distributor Link: www.lcsc.com; LCSC: C412974
R1104 R1105 = RES_0402: Resistor SMD 0402; Manufacturer: PANASONIC; Manufacturer Part Number: ERJ2GEJ391X; Distributor Link: www.lcsc.com; LCSC: C412983
U1101 = SP3494CN-L/TR: 3.3V Low Power RS-485 / RS-422 Transceiver SOIC-8; Manufacturer: MaxLinear; Manufacturer Part Number: SP3494CN-L/TR

## Sheet Interface - USB-C.SchDoc: [12] Interface - USB-C
size A4; ApprovedBy: Nagy Richard; CheckedBy: Nagy Richard; Author: Nagy Richard; CompanyName: EmbedCore; DrawnBy: Nagy Richard; Engineer: Nagy Richard; Organization: EmbedCore; DocumentNumber: 12; Revision: 1.0; SheetNumber: 12; SheetTotal: 15
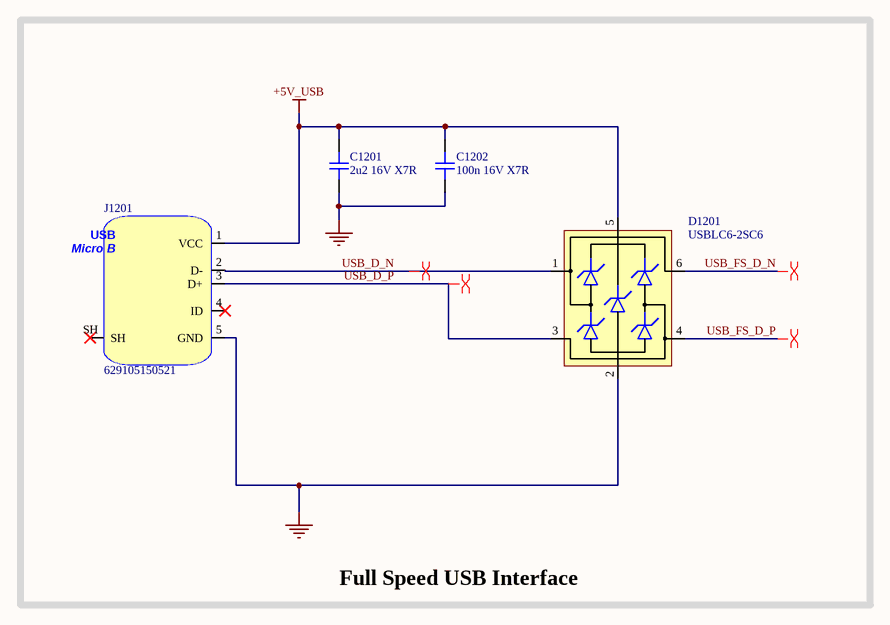
[diagram p11: Interface - USB-C.SchDoc]

### Parts
C1201  2u2 16V X7R  [CAP_0603]
C1202  100n 16V X7R  [CAP_0402]
D1201  USBLC6-2SC6  [SOT-23-6]
J1201  629105150521  [629105150521]

### Blocks framed on the sheet
Full Speed USB Interface: C1201 C1202 D1201 J1201

### Nets
+5V_USB: C1201.2 C1202.2 D1201.5(VBUS) J1201.1(VCC)
GND: C1201.1 C1202.1 D1201.2(GND) J1201.5(GND)
USB_D_N: D1201.1(IO1) J1201.2(D-)
USB_D_P: D1201.3(IO2) J1201.3(D+)
USB_FS_D_N: D1201.6(IO1)
USB_FS_D_P: D1201.4(IO2)

Not connected (* = marked no-connect by the designer): J1201 4(ID)* SH*

### Layout directives
differential pair: USB_D_N, USB_D_P, USB_FS_D_N, USB_FS_D_P

### Notes on the sheet
- Title:
- Drawn By:
- Page Contents:
- Checked By:
- Size:
- Date:
- File:
- License:
- Email:
- A4
- Number:
- Time:
- Revision:
- Sheet
- Website:
- of
- (in symbol 629105150521) USB; Micro B

### Library data of the parts
C1201 = CAP_0603: as C1101 on sheet Interface - RS485; Distributor Link: www.lcsc.com; LCSC: C914769; Rating: *; Dielectric: *
C1202 = CAP_0402: as C1102 on sheet Interface - RS485; Distributor Link: www.lcsc.com; LCSC: C541464; Rating: *; Dielectric: *
D1201 = USBLC6-2SC6: Low-Capacitance ESD Protection USB; Manufacturer: STMicroelectronics; Manufacturer Part Number: USBLC6-2SC6; Distributor Link: https://www.mouser.de/ProductDetail/STMicroelectronics/USBLC6-2SC6?qs=po45yt2pPpu%2FhNIlwQdTlg%3D%3D
J1201 = 629105150521: USB Connector Type Micro B 2.0 SMD; Manufacturer: Wurth; Manufacturer Part Number: 629105150521; Distributor Link: https://www.mouser.de/ProductDetail/Wurth-Elektronik/629105150521?qs=a9WhcLg8qCzXiH7kZP8GRQ%3D%3D

## Sheet Interface - Programmer.SchDoc: [13] Interface - Programmer
size A4; ApprovedBy: Nagy Richard; CheckedBy: Nagy Richard; Author: Nagy Richard; CompanyName: EmbedCore; DrawnBy: Nagy Richard; Engineer: Nagy Richard; Organization: EmbedCore; DocumentNumber: 13; Revision: 1.0; SheetNumber: 13; SheetTotal: 15
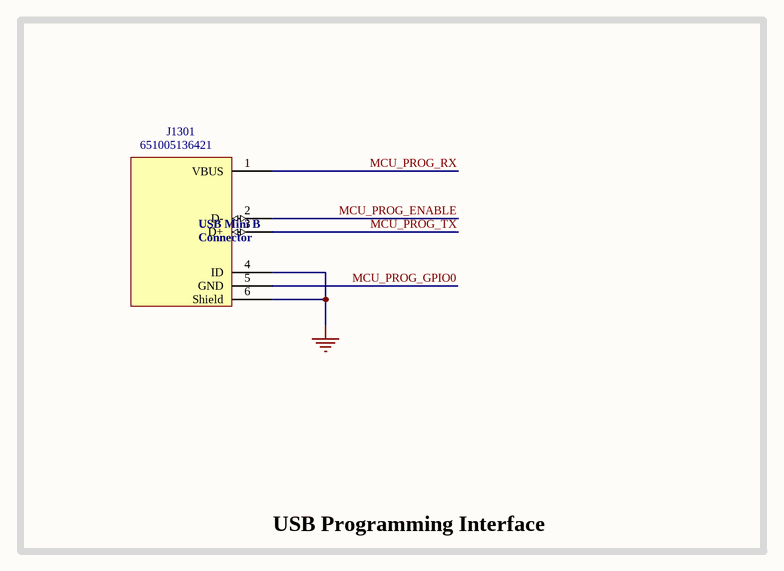
[diagram p12: Interface - Programmer.SchDoc]

### Parts
J1301  651005136421  [651005136421]

### Blocks framed on the sheet
USB Programming Interface: J1301

### Nets
GND: J1301.4(ID) J1301.6(Shield)
MCU_PROG_ENABLE: J1301.2(D-)
MCU_PROG_GPIO0: J1301.5(GND)
MCU_PROG_RX: J1301.1(VBUS)
MCU_PROG_TX: J1301.3(D+)

### Notes on the sheet
- Title:
- Drawn By:
- Page Contents:
- Checked By:
- Size:
- Date:
- File:
- License:
- Email:
- A4
- Number:
- Time:
- Revision:
- Sheet
- Website:
- of
- (in symbol 651005136421) USB Mini B; Connector

### Library data of the parts
J1301 = 651005136421: USB Connectors WR-COM Type B 5Pin Vert Feml Mini

## Sheet User - User Led's.SchDoc: [13] User - User Led's
size A4; ApprovedBy: Nagy Richard; CheckedBy: Nagy Richard; Author: Nagy Richard; CompanyName: EmbedCore; DrawnBy: Nagy Richard; Engineer: Nagy Richard; Organization: EmbedCore; DocumentNumber: 13; Revision: 1.0; SheetNumber: 14; SheetTotal: 15
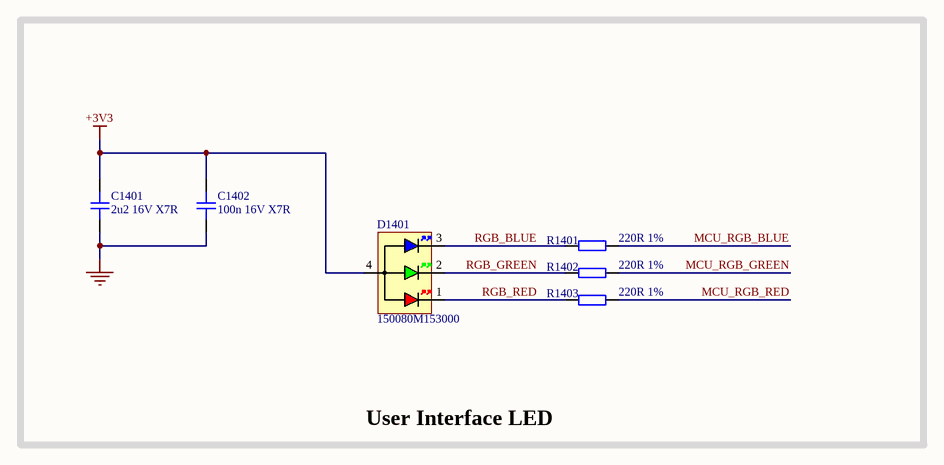
[diagram p13: User - User Led's.SchDoc]

### Parts
C1401  2u2 16V X7R  [CAP_0603]
C1402  100n 16V X7R  [CAP_0402]
D1401  150080M153000  [150080M153000]
R1401  220R 1%  [RES_0402]
R1402  220R 1%  [RES_0402]
R1403  220R 1%  [RES_0402]

### Blocks framed on the sheet
User Interface LED: C1401 C1402 D1401 R1401-R1403

### Nets
+3V3: C1401.2 C1402.2 D1401.4(AC)
GND: C1401.1 C1402.1
MCU_RGB_BLUE: R1401.1
MCU_RGB_GREEN: R1402.1
MCU_RGB_RED: R1403.1
RGB_BLUE: D1401.3(CB) R1401.2
RGB_GREEN: D1401.2(CG) R1402.2
RGB_RED: D1401.1(CR) R1403.2

### Notes on the sheet
- Title:
- Drawn By:
- Page Contents:
- Checked By:
- Size:
- Date:
- File:
- License:
- Email:
- A4
- Number:
- Time:
- Revision:
- Sheet
- Website:
- of

### Library data of the parts
C1401 = CAP_0603: as C1101 on sheet Interface - RS485; Distributor Link: www.lcsc.com; LCSC: C914769; Rating: *; Dielectric: *
C1402 = CAP_0402: as C1102 on sheet Interface - RS485; Distributor Link: www.lcsc.com; LCSC: C541464; Rating: *; Dielectric: *
D1401 = 150080M153000: RGB LED Common Anode SMD Diffused 0805 Top View; Manufacturer: Wurth; Manufacturer Part Number: 150080M153000; Distributor Link: https://www.mouser.de/ProductDetail/Wurth-Elektronik/150080M153000?qs=5aG0NVq1C4wI5cZ2wabu5A%3D%3D
R1401-R1403 = RES_0402: as R601 on sheet MCU - Power and I_O; Distributor Link: www.lcsc.com; LCSC: C409028

## Sheet Misc - Holes, Fiducials.SchDoc: [15] Misc - Holes, Fiducials
size A4; ApprovedBy: Nagy Richard; CheckedBy: Nagy Richard; Author: Nagy Richard; CompanyName: EmbedCore; DrawnBy: Nagy Richard; Engineer: Nagy Richard; Organization: EmbedCore; SheetNumber: 15; SheetTotal: 15
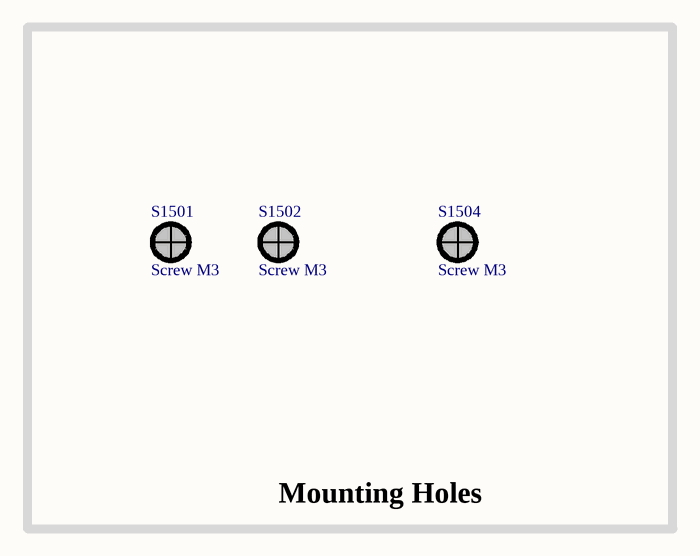
[diagram p14: Misc - Holes, Fiducials.SchDoc]

### Parts
S1501  Screw M3  [Screw M3]
S1502  Screw M3  [Screw M3]
S1504  Screw M3  [Screw M3]

### Blocks framed on the sheet
Mounting Holes: S1501 S1502 S1504

### Notes on the sheet
- Title:
- Drawn By:
- Page Contents:
- Checked By:
- Size:
- Date:
- File:
- License:
- Email:
- A4
- Number:
- Time:
- Revision:
- Sheet
- Website:
- of

## Nets that join several sheets
+3V3: Power Generation - LDO (C505.1 U501.5), MCU - Power and I_O (C601.2 C603.2 R601.2 U601.2), Motor - Motor Control (5 pins), Sensing - Temperature (D901.K D902.K), Sensing - Position (7 pins), Interface - RS485 (5 pins), User - User Led's (C1401.2 C1402.2 D1401.4)
+5V: Power Generation - Buck Converter (C406.2 C407.2 L401.2 R403.2), Power Generation - LDO (5 pins), Sensing - Position (J1001.3)
+VIN: Power Generation - Connector (5 pins), Power Generation - Buck Converter (C401.2 FB401.1), Motor - Motor Control (C701.2 C702.2 C703.2 U701.11), Sensing - Voltage (R801.2), Sensing - Temperature (J901.1 R901.2)
GND: Power Generation - Connector (C301.2 C302.2 D301.A J301.1), Power Generation - Buck Converter (9 pins), Power Generation - LDO (6 pins), MCU - Power and I_O (5 pins), Motor - Motor Control (13 pins), Sensing - Voltage (C801.1 R802.1), Sensing - Temperature (5 pins), Sensing - Position (7 pins), Interface - RS485 (8 pins), Interface - USB-C (C1201.1 C1202.1 D1201.2 J1201.5), Interface - Programmer (J1301.4 J1301.6), User - User Led's (C1401.1 C1402.1)
HAL_MCU_A: MCU - Power and I_O (U601.38), Sensing - Position (C1003.2 D1005.A R1001.1 R1004.1)
HAL_MCU_B: MCU - Power and I_O (U601.39), Sensing - Position (C1004.2 D1006.A R1002.1 R1005.1)
HAL_MCU_C: MCU - Power and I_O (U601.31), Sensing - Position (C1005.2 D1007.A R1003.1 R1006.1)
MCU_PROG_ENABLE: MCU - Power and I_O (R601.1 U601.3), Interface - Programmer (J1301.2)
MCU_PROG_GPIO0: MCU - Power and I_O (U601.27), Interface - Programmer (J1301.5)
MCU_PROG_RX: MCU - Power and I_O (U601.36), Interface - Programmer (J1301.1)
MCU_PROG_TX: MCU - Power and I_O (U601.37), Interface - Programmer (J1301.3)
MCU_RGB_BLUE: MCU - Power and I_O (U601.22), User - User Led's (R1401.1)
MCU_RGB_GREEN: MCU - Power and I_O (U601.21), User - User Led's (R1402.1)
MCU_RGB_RED: MCU - Power and I_O (U601.20), User - User Led's (R1403.1)
MOSFET_TEMP: MCU - Power and I_O (U601.19), Sensing - Temperature (C901.2 D901.A R901.1 R902.2)
MOTOR_IN1: MCU - Power and I_O (U601.5), Motor - Motor Control (U701.1)
MOTOR_IN2: MCU - Power and I_O (U601.4), Motor - Motor Control (U701.2)
MOTOR_NFAULT: MCU - Power and I_O (U601.6), Motor - Motor Control (R701.1 U701.4)
MOTOR_NSLEEP: MCU - Power and I_O (U601.7), Motor - Motor Control (U701.3)
MOTOR_TEMP: MCU - Power and I_O (U601.18), Sensing - Temperature (C902.2 D902.A J901.2 R903.2)
RS485_DE: MCU - Power and I_O (U601.8), Interface - RS485 (R1102.2 U1101.3)
RS485_DP_N: MCU - Power and I_O (U601.11), Interface - RS485 (U1101.1)
RS485_DP_P: MCU - Power and I_O (U601.10), Interface - RS485 (U1101.4)
RS485_NRE: MCU - Power and I_O (U601.9), Interface - RS485 (R1101.1 U1101.2)
USB_FS_D_N: MCU - Power and I_O (U601.14), Interface - USB-C (D1201.6)
USB_FS_D_P: MCU - Power and I_O (U601.13), Interface - USB-C (D1201.4)
VSENSE_IN: MCU - Power and I_O (U601.12), Sensing - Voltage (C801.2 R801.1 R802.2)